# Altium schematic sheet SDEC944-xD_Liaison_BoŒtiers_Auxiliaires.SchDoc: Liaison Boîtiers Auxiliaires
size 393 x 270 mm; CompanyName: Seccom; Address1: 521, rue du capt. François Garbit; Address2: 69440 Mornant; Address3: seccom@seccom.fr; Address4: www.seccom.fr; DocumentNumber: 7; SheetNumber: 7; SheetTotal: 22; PageSetup: Record=PageOptions|CenterHorizontal=True|CenterVertical=True|PrintScale=0.74|XCorrection=1.00|YCorrection=1.00|PrintKind=0|BorderSize=5000000|LeftOffset=0|BottomOffset=0|Orientation=2|PaperLength=1000|PaperWidth=1000|Scale=100|PaperSource=7|PrintQuality=-4|MediaType=1|DitherType=10|PaperKind=A4|PrintScaleMode=1
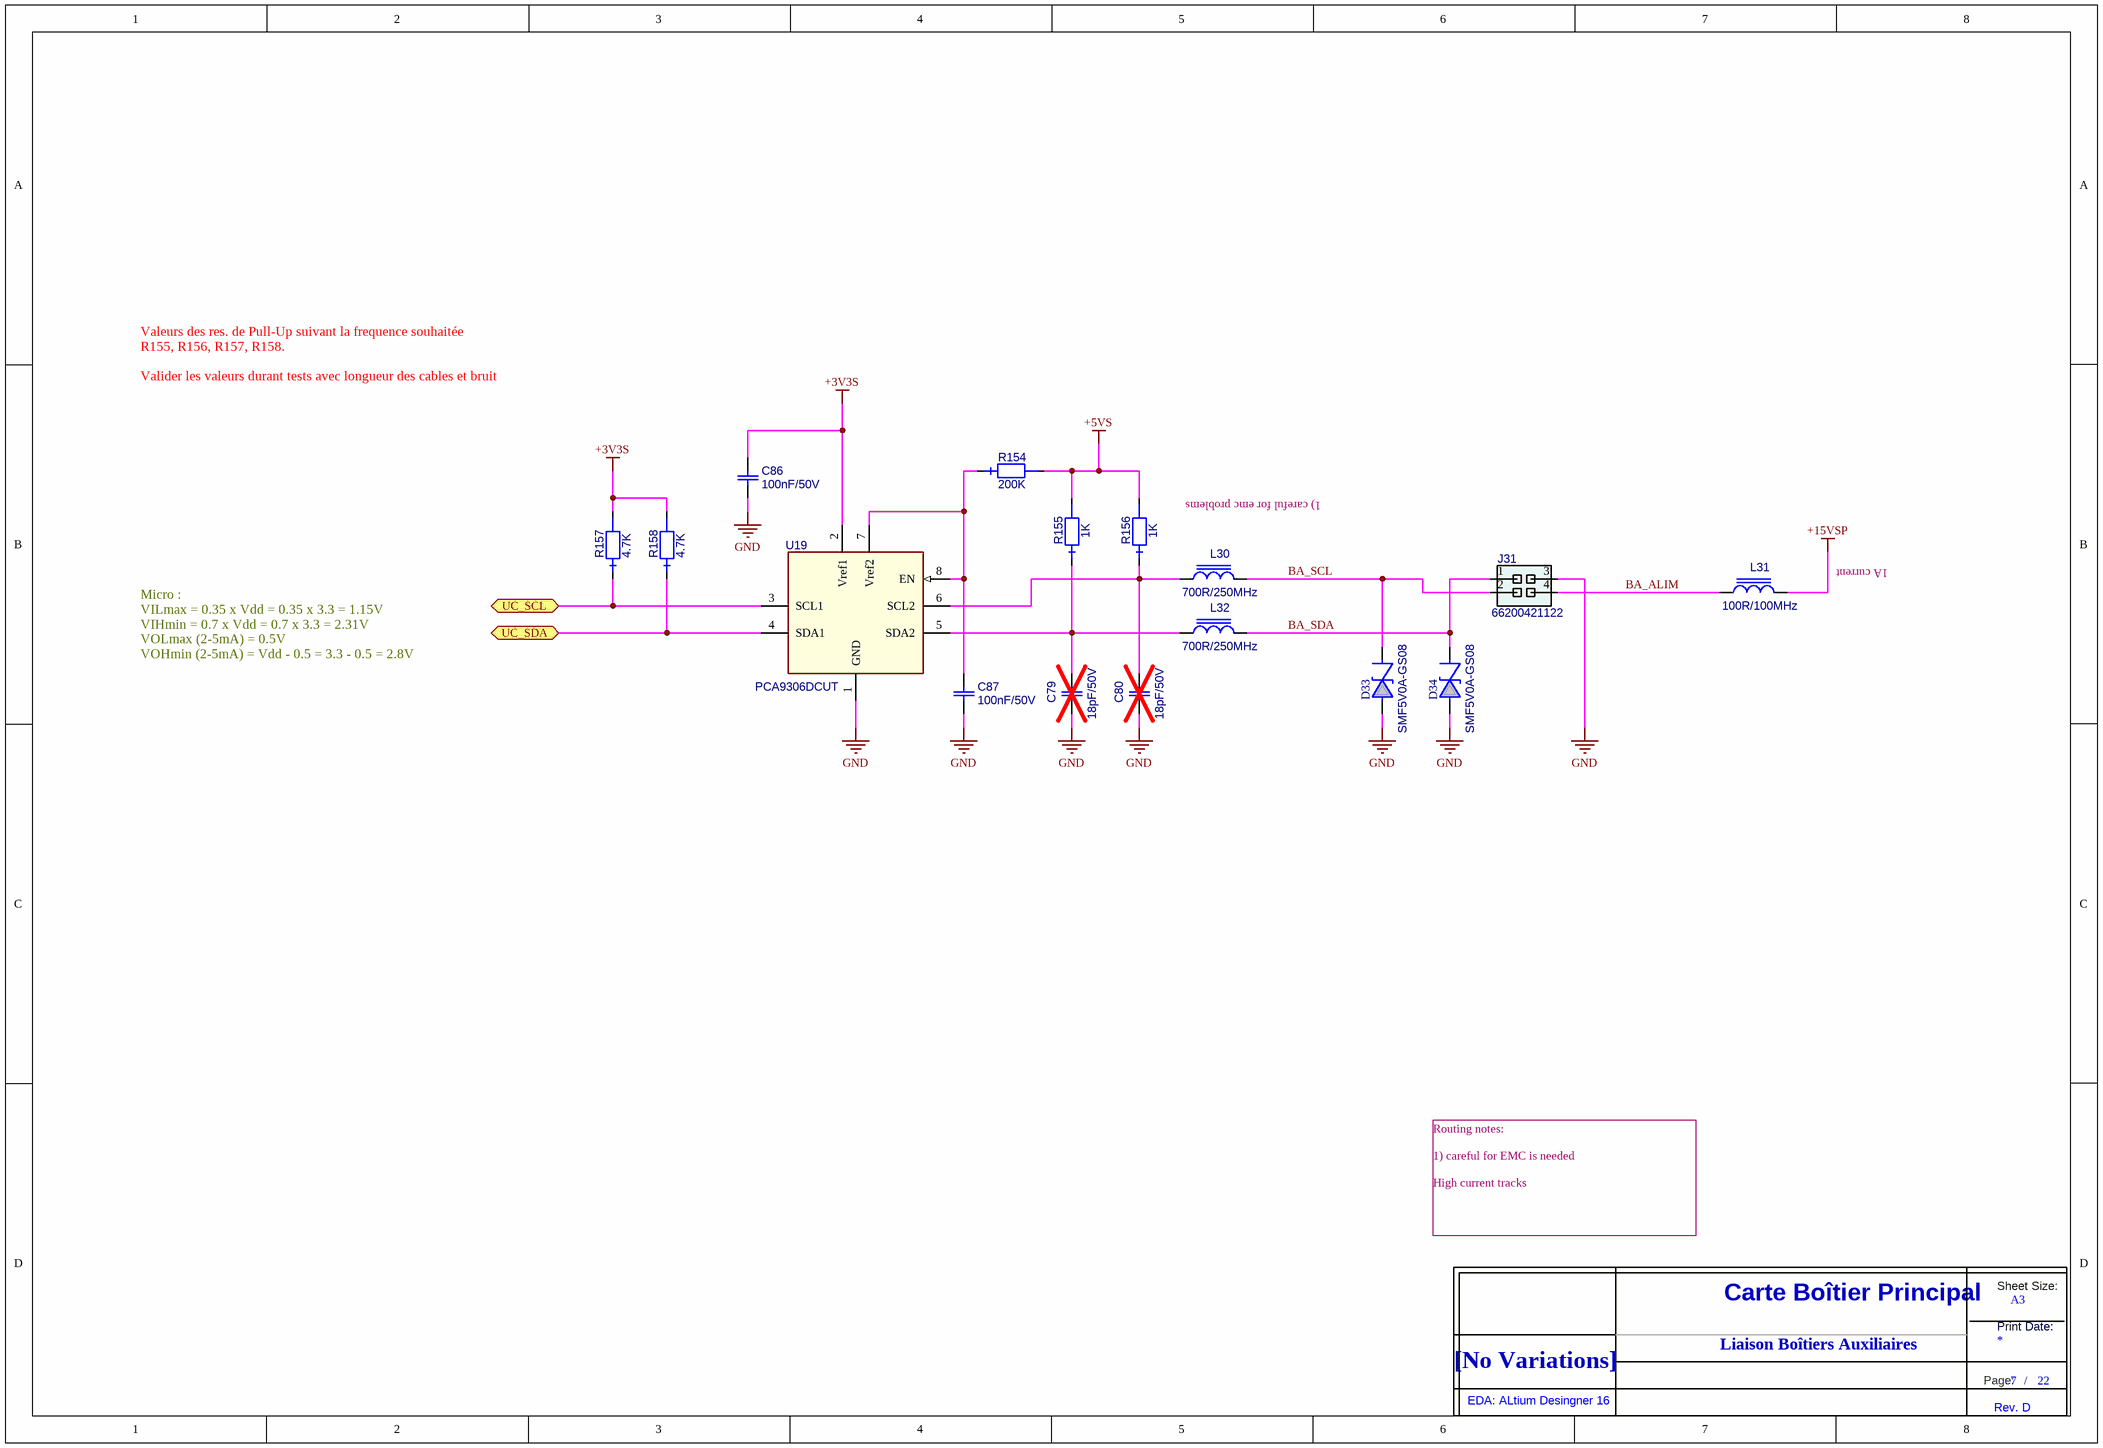
[diagram p0: SDEC944-xD_Liaison_BoŒtiers_Auxiliaires.SchDoc]

## Parts
C79  value 18pF/50V  [0603_ReflowSoldering_CAP]  (hidden comment: C_0603_NPO_5%_18P-50V)  (no BOM)
C80  value 18pF/50V  [0603_ReflowSoldering_CAP]  (hidden comment: C_0603_NPO_5%_18P-50V)  (no BOM)
C86  value 100nF/50V  [0603_ReflowSoldering_CAP]  (hidden comment: C_0603_X7R_10%_100N-50V)
C87  value 100nF/50V  [0603_ReflowSoldering_CAP]  (hidden comment: C_0603_X7R_10%_100N-50V)
D33  SMF5V0A-GS08  [DO219AB-SMF-P_ReflowSoldering]
D34  SMF5V0A-GS08  [DO219AB-SMF-P_ReflowSoldering]
J31  value 66200421122  [MICRO-MATE-N-LOK_WURTH+TYCO_2X02_D]  (hidden comment: MICRO-MATE-N-LOK_WURTH_2X02_D)
L30  value 700R/250MHz  [0603_ReflowSoldering_CAP]  (hidden comment: IND_FERRITE_0603_742792643)
L31  value 100R/100MHz  [1812_ReflowSoldering_SELF]  (hidden comment: IND_FERRITE_1812_74279226101)
L32  value 700R/250MHz  [0603_ReflowSoldering_CAP]  (hidden comment: IND_FERRITE_0603_742792643)
R154  value 200K  [0603_ReflowSoldering_RES]  (hidden comment: RES_0603_1%_100PPM_200K)
R155  value 1K  [0603_ReflowSoldering_RES]  (hidden comment: RES_0603_1%_100PPM_1K)
R156  value 1K  [0603_ReflowSoldering_RES]  (hidden comment: RES_0603_1%_100PPM_1K)
R157  value 4.7K  [0603_ReflowSoldering_RES]  (hidden comment: RES_0603_1%_100PPM_4.7K)
R158  value 4.7K  [0603_ReflowSoldering_RES]  (hidden comment: RES_0603_1%_100PPM_4.7K)
Title_new  DNI  (value not drawn)  (graphical)
U19  PCA9306DCUT  [VSSOP_008_E0,5_L3,1MM]

## Ports
UC_SCL, UC_SDA

## Nets
+3V3S: C86.1 R157.2 R158.2 U19.2(Vref1)
+5VS: R154.2 R155.2 R156.2
+15VSP: L31.2
GND: C79.2 C80.2 C86.2 C87.2 D33.A D34.A J31.3 U19.1(GND)
BA_ALIM: J31.4 L31.1
BA_SCL: D33.K J31.2 L30.2
BA_SDA: D34.K J31.1 L32.2
UC_SCL: R157.1 U19.3(SCL1) ; port UC_SCL
UC_SDA: R158.1 U19.4(SDA1) ; port UC_SDA
NetC79_1: C79.1 L32.1 R155.1 U19.5(SDA2)
NetC80_1: C80.1 L30.1 R156.1 U19.6(SCL2)
NetC87_1: C87.1 R154.1 U19.7(Vref2) U19.8(EN)

## Notes on the sheet
- Valeurs des res. de Pull-Up suivant la frequence souhaitée
  R155, R156, R157, R158.
  Valider les valeurs durant tests avec longueur des cables et bruit
- (near R156) 1) careful for emc problems
- 1A current
- Micro :
  VILmax = 0.35 x Vdd = 0.35 x 3.3 = 1.15V
  VIHmin = 0.7 x Vdd = 0.7 x 3.3 = 2.31V
  VOLmax (2-5mA) = 0.5V
  VOHmin (2-5mA) = Vdd - 0.5 = 3.3 - 0.5 = 2.8V
- Routing notes:
  1) careful for EMC is needed
  High current tracks
- Liaison Boîtiers Auxiliaires
- (in symbol Title_new) Sheet Size:; Carte Boîtier Principal; A3; Print Date:; [No Variations]; Page:; /; EDA: ALtium Desingner 16; Rev. D

## Library data of the parts
C79 C80 = C_0603_NPO_5%_18P-50V: Condensateur céramique, NPO, 5%, CMS 0603, 18pF/50V; Creation: FB (04/07/12); Boitier: 0603; Remarque: {Remarque}; Fabricant: Kemet; Ref Fab: C0603C180J5GAC; Coeff: 1; ComponentLink2URL: o:\_Documentation\Datasheets\_BOITIERS\PASSIF_CMS\; Config: *; ComponentLink1Description: Datasheet; ComponentLink2Description: Datasheet Boitier; Supplier 1: Farnell; Supplier Part Number 1: 1414620
C86 C87 = C_0603_X7R_10%_100N-50V: Condensateur céramique, X7R, 10%, CMS 0603, 100nF/50V; Creation: FB (29/02/12); Boitier: 0603; Remarque: {Remarque}; Fabricant: Kemet; Ref Fab: C0603C104K5RAC; Coeff: 1; ComponentLink1URL: O:\_Documentation\Datasheets\Kemet\Condos_Ceramic_CMS.pdf; ComponentLink2URL: o:\_Documentation\Datasheets\_BOITIERS\PASSIF_CMS\; Config: *; ComponentLink1Description: Datasheet; ComponentLink2Description: Datasheet Boitier; Supplier 1: Farnell; Supplier Part Number 1: 1288255
D33 D34 = SMF5V0A-GS08: Diode Transil/TVS unidirectionnelle (A), 200W, 5V, CMS; Creation: LJ; Boitier: DO219AB/SMF; Remarque: {Remarque}; Fabricant: Vishay; Coeff: 1; Verification: *; Ref Fab: SMF5V0A-GS08; ComponentLink1URL: o:\_Documentation\Datasheets\Vishay\SMF5V0A~51A.pdf; ComponentLink2URL: o:\_Documentation\Datasheets\_BOITIERS\; Config: *; ComponentLink1Description: Datasheet; ComponentLink2Description: Datasheet Boitier; Value: SMF5V0A-GS08; Supplier 1: Farnell; Supplier 2: Mouser; Supplier Part Number 1: 1617696; Supplier Part Number 2: 78-SMF5V0A
J31 = MICRO-MATE-N-LOK_WURTH_2X02_D: Embase type Micro Mate-n-Lok, e3mm, 4pts, droit, cont. étamés 20mR, 250V/5A, Iso 1500V, -40/+105°C; Creation: LJ (01/08/12); Boitier: Micro Mate-n-Lok 4 D; Remarque: {Remarque}; Fabricant: Wurth Elektronik; Coeff: 1; Ref Fab: 66200421122; ComponentLink1URL: o:\_Documentation\Datasheets\; ComponentLink2URL: o:\_Documentation\Datasheets\; Config: *; ComponentLink1Description: Datasheet; ComponentLink2Description: Datasheet Boitier
L30 L32 = IND_FERRITE_0603_742792643: Inductance à ferrite multicouches CMS, imp=700R@250MHz, +/-25%, Rdc=350mR, I=400mA; Creation: PDP (02/08/12); Boitier: 0603; Coeff: 1; Fabricant: Wurth Elektronik; ComponentLink1URL: o:\_Documentation\Datasheets\Murata\Ferrite_BLM21P.pdf; Config: *; ComponentLink1Description: Datasheet; ComponentLink2Description: Datasheet Boitier; Ref Fab: 742792643; Supplier 1: Farnell; Supplier Part Number 1: 1800349
L31 = IND_FERRITE_1812_74279226101: Inductance à ferrite multicouches CMS, imp=100R@>100MHz, +/-25%, Rdc=6mR, I=8A; Creation: PDP (20/09/12); Boitier: 1812; Coeff: 1; Fabricant: Wurth Elektronik; ComponentLink1URL: O:\_Documentation\Datasheets\Wurth_Elektronik\74279226101.pdf; Config: *; ComponentLink1Description: Datasheet; ComponentLink2Description: Datasheet Boitier; Ref Fab: 74279226101; Supplier 1: Mouser; Supplier Part Number 1: 710-74279226101; Supplier 2: Farnell; Supplier Part Number 2: 2066855
R154 = RES_0603_1%_100PPM_200K: Résistance, 0.100W, 1%, 100ppm, 75V, 200K; Creation: JPL (05/07/12); Boitier: 0603; Remarque: {Remarque}; Fabricant: Vishay; Ref Fab: CRCW0603200KFKEA; Coeff: 1; Verification: *; ComponentLink1URL: O:\_Documentation\Datasheets\Vishay\Resistances_D-CRCWe3.pdf; ComponentLink2URL: o:\_Documentation\Datasheets\_BOITIERS\PASSIF_CMS\; Config: *; ComponentLink1Description: Datasheet; ComponentLink2Description: Datasheet Boitier; Supplier 1: Farnell; Supplier 2: RadioSpares; Supplier Part Number 1: 1469776; Supplier Part Number 2: 6789967
R155 R156 = RES_0603_1%_100PPM_1K: Résistance, 0.100W, 1%, 100ppm, 75V, 1K; Creation: JPL (05/07/12); Boitier: 0603; Remarque: {Remarque}; Fabricant: Vishay; Ref Fab: CRCW06031K00FKEA; Coeff: 1; Verification: *; ComponentLink1URL: O:\_Documentation\Datasheets\Vishay\Resistances_D-CRCWe3.pdf; ComponentLink2URL: o:\_Documentation\Datasheets\_BOITIERS\PASSIF_CMS\; Config: *; ComponentLink1Description: Datasheet; ComponentLink2Description: Datasheet Boitier; Supplier 1: Farnell; Supplier 2: RadioSpares; Supplier Part Number 1: 1469740; Supplier Part Number 2: 6789875
R157 R158 = RES_0603_1%_100PPM_4.7K: Résistance, 0.100W, 1%, 100ppm, 75V, 4.7K; Creation: JPL (05/07/12); Boitier: 0603; Remarque: {Remarque}; Fabricant: Vishay; Ref Fab: CRCW06034K70FKEA; Coeff: 1; Verification: *; ComponentLink1URL: O:\_Documentation\Datasheets\Vishay\Resistances_D-CRCWe3.pdf; ComponentLink2URL: o:\_Documentation\Datasheets\_BOITIERS\PASSIF_CMS\; Config: *; ComponentLink1Description: Datasheet; ComponentLink2Description: Datasheet Boitier; Supplier 1: Farnell; Supplier 2: RadioSpares; Supplier Part Number 1: 1469807; Supplier Part Number 2: 6790484
Title_new = Title_new
U19 = PCA9306DCUT: DUAL BIDIRECTIONAL I2C BUS AND SMBus  VOLTAGE-LEVEL TRANSLATOR ,1.2V à 5V, CMS; Creation: CHD (21/02/12); Reference: {Reference}; Boitier: VSSOP-8; Fabricant: Texas Instruments; Coeff: 1; Ref Fab: PCA9306DCUT; ComponentLink1URL: o:\_Documentation\Datasheets\Texas\PCA9306.pdf; ComponentLink2URL: o:\_Documentation\Datasheets\Texas\PCA9306.pdf; Config: *; ComponentLink1Description: Datasheet; ComponentLink2Description: Datasheet Boitier; Supplier 1: Farnell; Supplier Part Number 1: 2126364; Value: PCA9306DCUT; Supplier 2: Mouser; Supplier Part Number 2: 595-PCA9306DCUT